# EAGLE design RAMPS_1.4.2.3 (EAGLE 7.5.0)
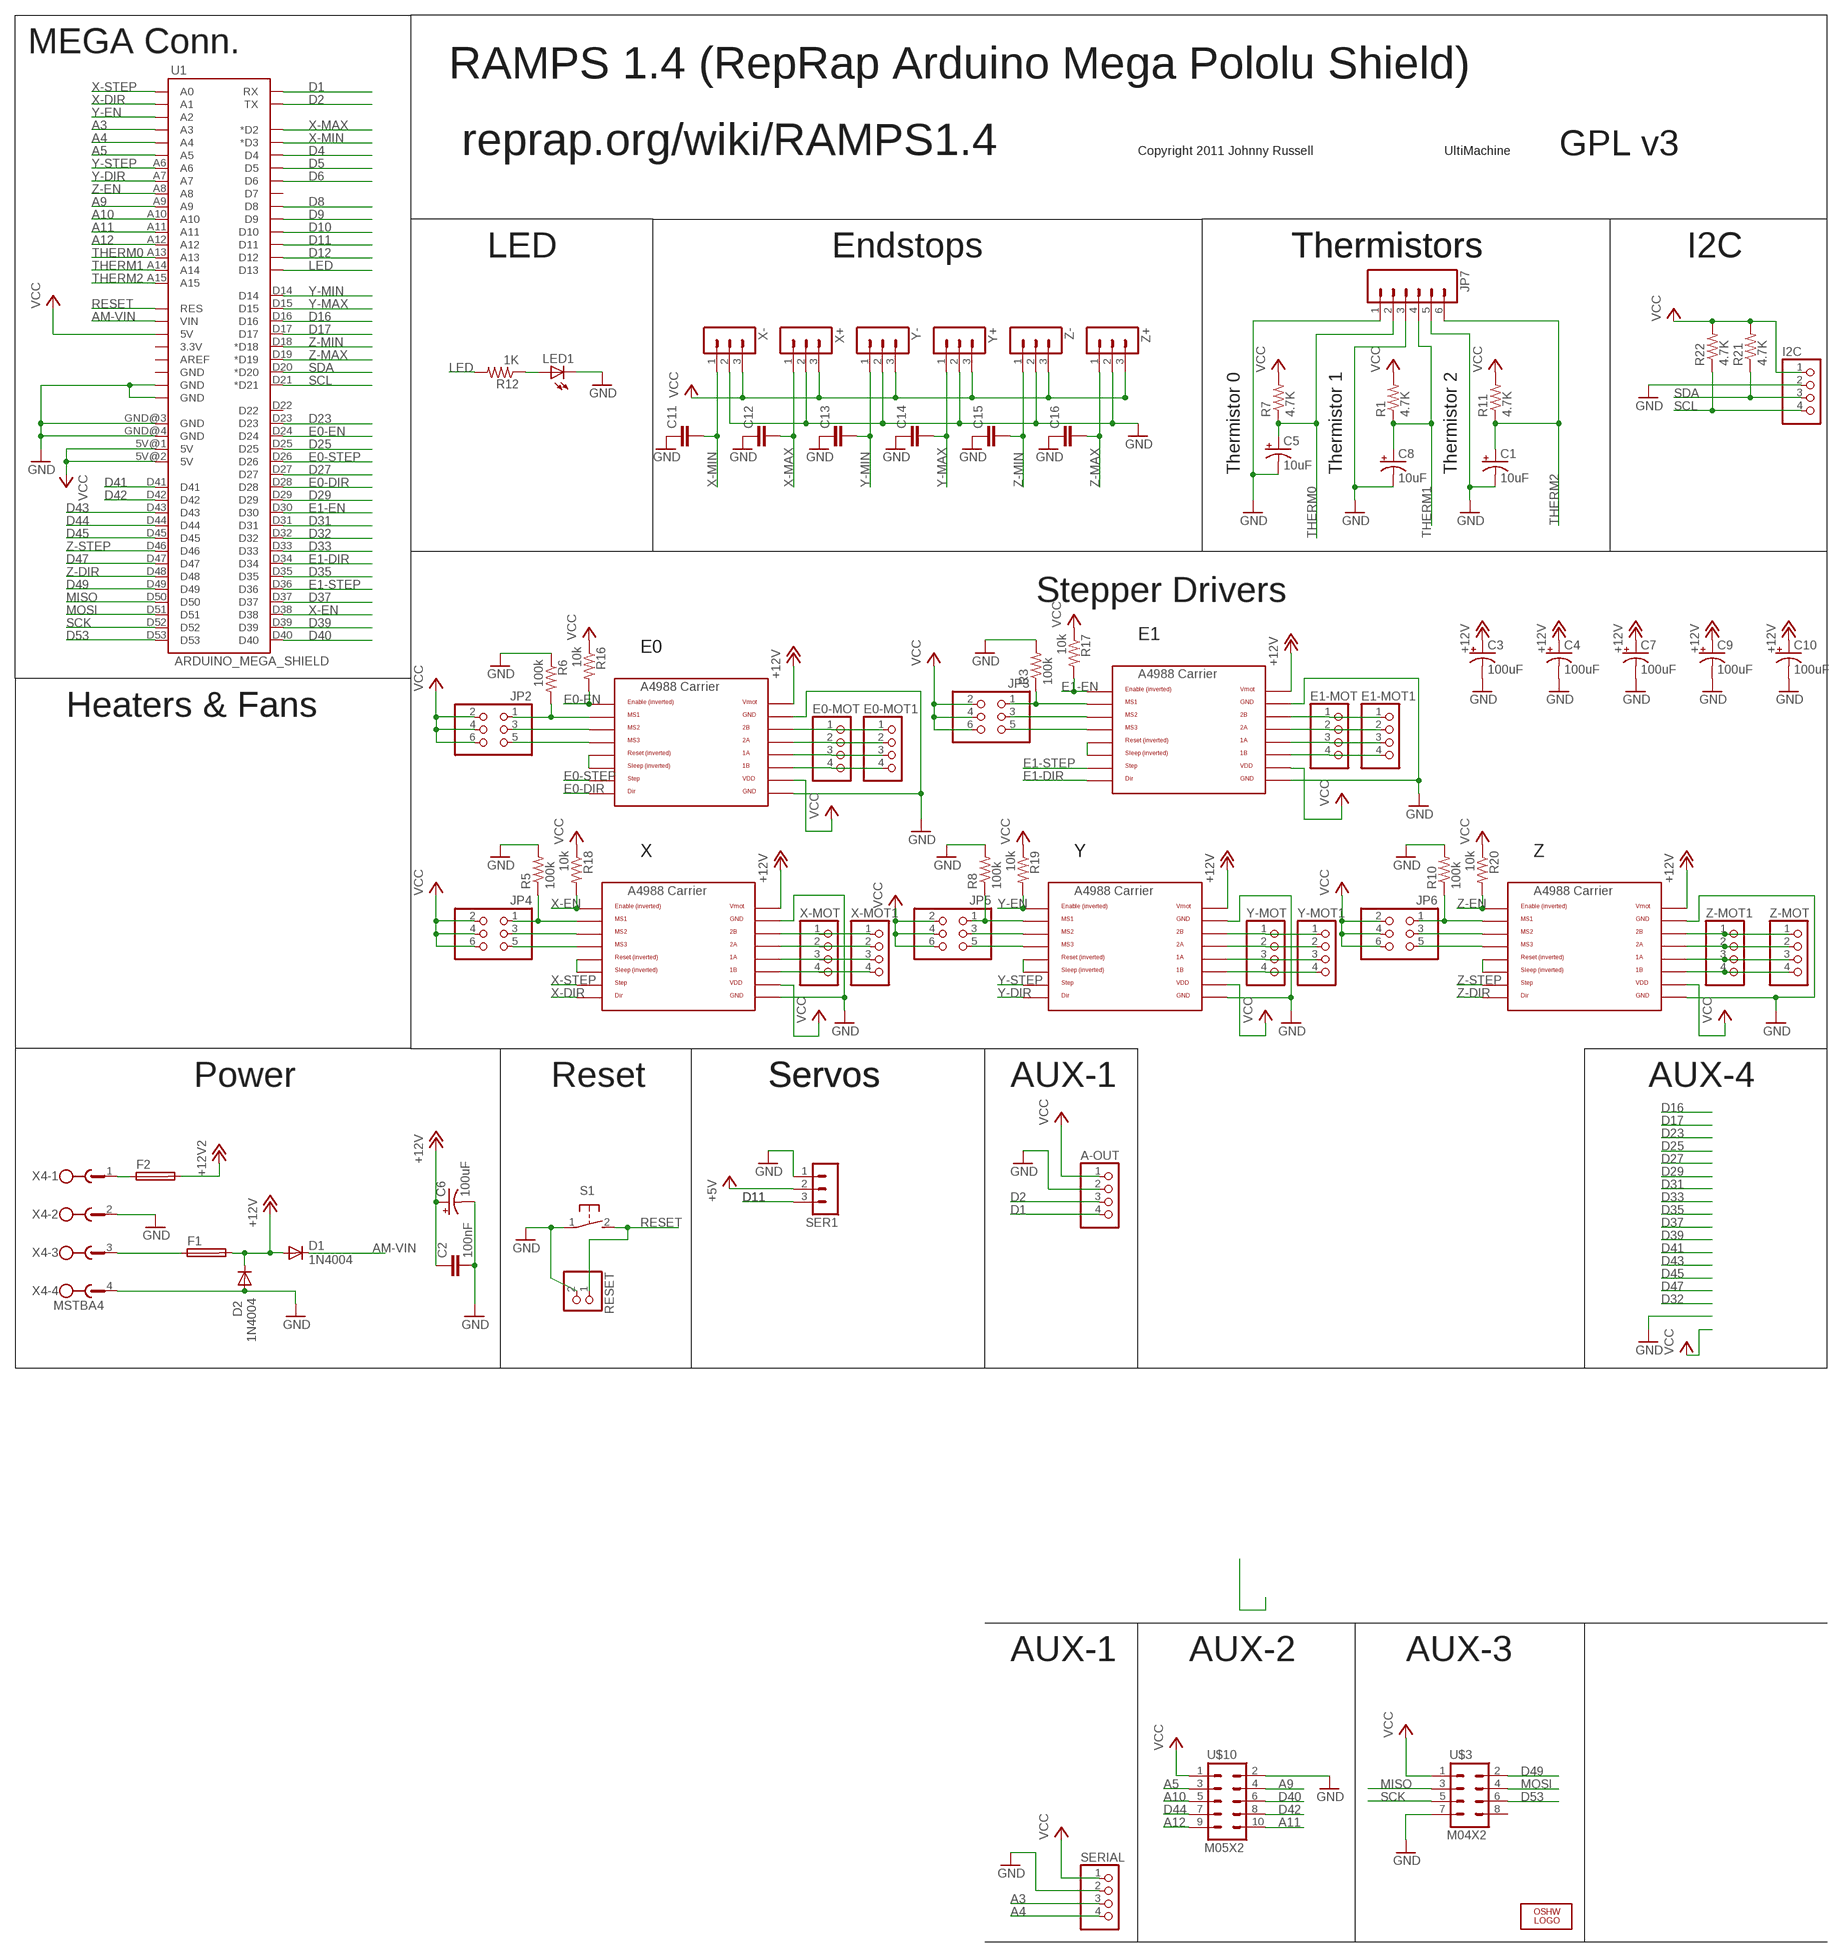
[diagram p0: schematic, sheet 1]

## Parts
A-OUT  PINHD-1X4  [1X04]
C1  10uF  CPOL-US153CLV-0405  [153CLV-0405]
C2  100nF  C-EUC0805  [C0805]
C3  100uF  CPOL-US153CLV-0605  [153CLV-0605]
C4  100uF  CPOL-US153CLV-0605  [153CLV-0605]
C5  10uF  CPOL-US153CLV-0405  [153CLV-0405]
C6  100uF  CPOL-US153CLV-0605  [153CLV-0605]
C7  100uF  CPOL-US153CLV-0605  [153CLV-0605]
C8  10uF  CPOL-US153CLV-0405  [153CLV-0405]
C9  100uF  CPOL-US153CLV-0605  [153CLV-0605]
C10  100uF  CPOL-US153CLV-0605  [153CLV-0605]
C11  C-EUC0805  [C0805]
C12  C-EUC0805  [C0805]
C13  C-EUC0805  [C0805]
C14  C-EUC0805  [C0805]
C15  C-EUC0805  [C0805]
C16  C-EUC0805  [C0805]
D1  1N4004  [DO41-10]
D2  1N4004  [DO41-10]
E0-MOT  PINHD-1X4  [1X04]
E0-MOT1  PINHD-1X4  [1X04]
E1-MOT  PINHD-1X4  [1X04]
E1-MOT1  PINHD-1X4  [1X04]
F1  FUSE_MCCQ-122  [FUSE_MCCQ-122]
F2  FUSE_MCCQ-122  [FUSE_MCCQ-122]
I2C  PINHD-1X4  [1X04]
JP2  PINHD-2X3  [2X03]
JP3  PINHD-2X3  [2X03]
JP4  PINHD-2X3  [2X03]
JP5  PINHD-2X3  [2X03]
JP6  PINHD-2X3  [2X03]
JP7  M06SIP  [1X06]
LED1  LEDCHIP-LED0805  [CHIP-LED0805]
LOGO1  OSHW_LOGO_6MILX0100-NT  [OSHW_6X100_NOTEXT]
R1  4.7K  R-US_R0805  [R0805]
R3  100k  R-US_R0805  [R0805]
R5  100k  R-US_R0805  [R0805]
R6  100k  R-US_R0805  [R0805]
R7  4.7K  R-US_R0805  [R0805]
R8  100k  R-US_R0805  [R0805]
R10  100k  R-US_R0805  [R0805]
R11  4.7K  R-US_R0805  [R0805]
R12  1K  R-US_R0805  [R0805]
R16  10k  R-US_R0805  [R0805]
R17  10k  R-US_R0805  [R0805]
R18  10k  R-US_R0805  [R0805]
R19  10k  R-US_R0805  [R0805]
R20  10k  R-US_R0805  [R0805]
R21  4.7K  R-US_R0805  [R0805]
R22  4.7K  R-US_R0805  [R0805]
RESET  PINHD-2  [PINHD-2]
S1  31-XX  [B3F-31XX]
SER1  3PIN-HEADER  [3PIN-HEADER]
SERIAL  PINHD-1X4  [1X04]
U1  ARDUINO_MEGA_SHIELD  [ARDUINO_MEGA_SHIELD]
U$3  M04X2  [2X4]
U$4  A4988BREAKOUT  [A4988BREAKOUT]
U$5  A4988BREAKOUT  [A4988BREAKOUT]
U$6  A4988BREAKOUT  [A4988BREAKOUT]
U$7  A4988BREAKOUT  [A4988BREAKOUT]
U$8  A4988BREAKOUT  [A4988BREAKOUT]
U$10  M05X2  [2X5]
X4  MSTBA4  [MSTBA4]
X+  3PIN-HEADER  [3PIN-HEADER]
X-  3PIN-HEADER  [3PIN-HEADER]
X-MOT  PINHD-1X4  [1X04]
X-MOT1  PINHD-1X4  [1X04]
Y+  3PIN-HEADER  [3PIN-HEADER]
Y-  3PIN-HEADER  [3PIN-HEADER]
Y-MOT  PINHD-1X4  [1X04]
Y-MOT1  PINHD-1X4  [1X04]
Z+  3PIN-HEADER  [3PIN-HEADER]
Z-  3PIN-HEADER  [3PIN-HEADER]
Z-MOT  PINHD-1X4  [1X04]
Z-MOT1  PINHD-1X4  [1X04]

## Nets
+5V: SER1.2
+12V: C2.1 C3.+ C4.+ C6.+ C7.+ C9.+ C10.+ D1.A D2.C F1.2-1 F1.2-2 U$4.VMOT U$5.VMOT U$6.VMOT U$7.VMOT U$8.VMOT
+12V2: F2.2-1 F2.2-2
A3: SERIAL.3 U1.A3
A4: SERIAL.4 U1.A4
A5: U1.A5 U$10.3
A9: U1.A9 U$10.4
A10: U1.A10 U$10.5
A11: U1.A11 U$10.10
A12: U1.A12 U$10.9
AM-VIN: D1.C U1.VIN
D1: A-OUT.4 U1.RX
D2: A-OUT.3 U1.TX
D4: U1.D4
D5: U1.D5
D6: U1.D6
D8: U1.D8
D9: U1.D9
D10: U1.D10
D11: SER1.3 U1.D11
D12: U1.D12
D16: U1.D16
D17: U1.D17
D23: U1.D23
D25: U1.D25
D27: U1.D27
D29: U1.D29
D31: U1.D31
D32: U1.D32
D33: U1.D33
D35: U1.D35
D37: U1.D37
D39: U1.D39
D40: U1.D40 U$10.6
D41: U1.D41
D42: U1.D42 U$10.8
D43: U1.D43
D44: U1.D44 U$10.7
D45: U1.D45
D47: U1.D47
D49: U1.D49 U$3.2
D53: U1.D53 U$3.6
E0-DIR: U1.D28 U$4.DIR
E0-EN: R16.2 U1.D24 U$4.EN
E0-STEP: U1.D26 U$4.STEP
E1-DIR: U1.D34 U$5.DIR
E1-EN: R17.2 U1.D30 U$5.EN
E1-STEP: U1.D36 U$5.STEP
GND: A-OUT.2 C1.- C2.2 C3.- C4.- C5.- C6.- C7.- C8.- C9.- C10.- C11.1 C12.1 C13.1 C14.1 C15.1 C16.1 D2.A I2C.2 JP7.1 JP7.3 JP7.5 LED1.C R3.2 R5.2 R6.1 R8.2 R10.2 RESET.2 S1.1(P) SER1.1 SERIAL.2 U1.GND@0(GND) U1.GND@1(GND) U1.GND@3(GND) U1.GND@4(GND) U$3.7 U$4.GND U$4.GND@0(GND) U$5.GND U$5.GND@0(GND) U$6.GND U$6.GND@0(GND) U$7.GND U$7.GND@0(GND) U$8.GND U$8.GND@0(GND) U$10.2 X4.2 X4.4 X+.2 X-.2 Y+.2 Y-.2 Z+.2 Z-.2
LED: R12.2 U1.D13
MISO: U1.D50 U$3.3
MOSI: U1.D51 U$3.4
N$3: E0-MOT1.1 E0-MOT.1 U$4.2B
N$4: E0-MOT1.2 E0-MOT.2 U$4.2A
N$5: JP2.1 R6.2 U$4.MS1
N$6: JP2.5 U$4.MS3
N$8: U$4.RST U$4.SLP(SLEEP)
N$9: JP2.3 U$4.MS2
N$10: E0-MOT1.3 E0-MOT.3 U$4.1A
N$11: E0-MOT1.4 E0-MOT.4 U$4.1B
N$12: E1-MOT1.1 E1-MOT.1 U$5.2B
N$13: E1-MOT1.2 E1-MOT.2 U$5.2A
N$14: JP4.1 R5.1 U$6.MS1
N$15: JP4.3 U$6.MS2
N$16: E1-MOT1.3 E1-MOT.3 U$5.1A
N$17: JP5.3 U$7.MS2
N$18: E1-MOT1.4 E1-MOT.4 U$5.1B
N$19: JP4.5 U$6.MS3
N$20: U$6.RST U$6.SLP(SLEEP)
N$21: U$6.2B X-MOT1.1 X-MOT.1
N$22: U$6.2A X-MOT1.2 X-MOT.2
N$23: U$7.RST U$7.SLP(SLEEP)
N$24: U$5.RST U$5.SLP(SLEEP)
N$25: JP3.1 R3.1 U$5.MS1
N$26: U$6.1A X-MOT1.3 X-MOT.3
N$27: U$6.1B X-MOT1.4 X-MOT.4
N$28: U$7.2B Y-MOT1.1 Y-MOT.1
N$29: U$7.2A Y-MOT1.2 Y-MOT.2
N$30: U$7.1A Y-MOT1.3 Y-MOT.3
N$31: JP5.5 U$7.MS3
N$33: JP5.1 R8.1 U$7.MS1
N$34: JP3.5 U$5.MS3
N$35: JP3.3 U$5.MS2
N$36: U$7.1B Y-MOT1.4 Y-MOT.4
N$37: JP6.3 U$8.MS2
N$38: U$8.RST U$8.SLP(SLEEP)
N$39: JP6.5 U$8.MS3
N$40: JP6.1 R10.1 U$8.MS1
N$41: U$8.2B Z-MOT1.1 Z-MOT.1
N$42: U$8.2A Z-MOT1.2 Z-MOT.2
N$43: U$8.1A Z-MOT1.3 Z-MOT.3
N$44: U$8.1B Z-MOT1.4 Z-MOT.4
N$46: LED1.A R12.1
N$53: F2.1-1 F2.1-2 X4.1
N$54: F1.1-1 F1.1-2 X4.3
RESET: RESET.1 S1.2(S) U1.RES
SCK: U1.D52 U$3.5
SCL: I2C.4 R22.1 U1.D21(*D21)
SDA: I2C.3 R21.1 U1.D20(*D20)
THERM0: C5.+ JP7.2 R7.1 U1.A13
THERM1: C8.+ JP7.4 R1.1 U1.A14
THERM2: C1.+ JP7.6 R11.1 U1.A15
VCC: A-OUT.1 I2C.1 JP2.2 JP2.4 JP2.6 JP3.2 JP3.4 JP3.6 JP4.2 JP4.4 JP4.6 JP5.2 JP5.4 JP5.6 JP6.2 JP6.4 JP6.6 R1.2 R7.2 R11.2 R16.1 R17.1 R18.1 R19.1 R20.1 R21.2 R22.2 SERIAL.1 U1.5V@0(5V) U1.5V@1(5V) U1.5V@2(5V) U$3.1 U$4.VDD U$5.VDD U$6.VDD U$7.VDD U$8.VDD U$10.1 X+.3 X-.3 Y+.3 Y-.3 Z+.3 Z-.3
X-DIR: U1.A1 U$6.DIR
X-EN: R18.2 U1.D38 U$6.EN
X-MAX: C12.2 U1.D2(*D2) X+.1
X-MIN: C11.2 U1.D3(*D3) X-.1
X-STEP: U1.A0 U$6.STEP
Y-DIR: U1.A7 U$7.DIR
Y-EN: R19.2 U1.A2 U$7.EN
Y-MAX: C14.2 U1.D15 Y+.1
Y-MIN: C13.2 U1.D14 Y-.1
Y-STEP: U1.A6 U$7.STEP
Z-DIR: U1.D48 U$8.DIR
Z-EN: R20.2 U1.A8 U$8.EN
Z-MAX: C16.2 U1.D19(*D19) Z+.1
Z-MIN: C15.2 U1.D18(*D18) Z-.1
Z-STEP: U1.D46 U$8.STEP
Unconnected: U1.3.3V U1.AREF U1.D7 U1.D22 U1.GND@2(GND) U$3.8

## Notes on the sheet
- MEGA Conn.
- RAMPS 1.4 (RepRap Arduino Mega Pololu Shield)
- reprap.org/wiki/RAMPS1.4 | Copyright 2011 Johnny Russell | UltiMachine | GPL v3
- LED | Endstops | Thermistors | Thermistors | I2C
- Thermistor 0 | Thermistor 1 | Thermistor 2
- Stepper Drivers
- E1
- E0
- Heaters & Fans
- X | Y | Z
- Power | Reset | Servos | Servos | AUX-1 | AUX-4
- AUX-1 | AUX-2 | AUX-3

## Library data of the parts
A-OUT E0-MOT E0-MOT1 E1-MOT E1-MOT1 I2C SERIAL X-MOT X-MOT1 Y-MOT Y-MOT1 Z-MOT Z-MOT1 = RepRapjr:PINHD-1X4: PIN HEADER
C1 C3-C10 = adafruit:CPOL-US: POLARIZED CAPACITOR, American symbol
C2 = resistor:C-EU: CAPACITOR, European symbol
C11-C16 = rcl:C-EU: CAPACITOR, European symbol
D1 D2 = diode:1N4004: DIODE general purpose rectifier, 1 A
F1 F2 = myLib:FUSE_MCCQ-122
JP2-JP6 = pinhead:PINHD-2X3: PIN HEADER
JP7 = SparkFun:M06: Header 6 Standard 6-pin 0.1" header. Use with straight break away headers (SKU : PRT-00116), right angle break away headers (PRT-00553), swiss pins (PRT-00743), machine pins (PRT-00117), and female headers (PRT-00115). Molex polarized connector foot print use with SKU : PRT-08094 with associated crimp pins and housings. NOTES ON THE VARIANTS LOCK and LOCK_LONGPADS... This footprint was designed to help hold the alignment of a through-hole component (i.e. 6-pin header) while soldering it into place. You may notice that each hole has been shifted either up or down by 0.005 of an inch from it's more standard position (which is a perfectly straight line). This slight alteration caused the pins (the squares in the middle) to touch the edges of the holes. Because they are alternating, it causes a "brace" to hold the component in place. 0.005 has proven to be the perfect amount of "off-center" position when using our standard breakaway headers. Although looks a little odd when you look at the bare footprint, once you have a header in there, the alteration is very hard to notice. Also, if you push a header all the way into place, it is covered up entirely on the bottom side. This idea of altering the position of holes to aid alignment will be further integrated into the Sparkfun Library for other footprints. It can help hold any component with 3 or more connection pins.
LED1 = led:LED: LED OSRAM: - CHIPLED LG R971, LG N971, LY N971, LG Q971, LY Q971, LO R971, LY R971 LH N974, LH R974 LS Q976, LO Q976, LY Q976 LO Q996 - Hyper CHIPLED LW Q18S LB Q993, LB Q99A, LB R99A - SideLED LS A670, LO A670, LY A670, LG A670, LP A670 LB A673, LV A673, LT A673, LW A673 LH A674 LY A675 LS A676, LA A676, LO A676, LY A676, LW A676 LS A679, LY A679, LG A679 - Hyper Micro SIDELED® LS Y876, LA Y876, LO Y876, LY Y876 LT Y87S - SmartLED LW L88C, LW L88S LB L89C, LB L89S, LG L890 LS L89K, LO L89K, LY L89K LS L896, LA L896, LO L896, LY L896 - TOPLED LS T670, LO T670, LY T670, LG T670, LP T670 LSG T670, LSP T670, LSY T670, LOP T670, LYG T670 LG T671, LOG T671, LSG T671 LB T673, LV T673, LT T673, LW T673 LH T674 LS T676, LA T676, LO T676, LY T676, LB T676, LH T676, LSB T676, LW T676 LB T67C, LV T67C, LT T67C, LS T67K, LO T67K, LY T67K, LW E67C LS E67B, LA E67B, LO E67B, LY E67B, LB E67C, LV E67C, LT E67C LW T67C LS T679, LY T679, LG T679 LS T770, LO T770, LY T770, LG T770, LP T770 LB T773, LV T773, LT T773, LW T773 LH T774 LS E675, LA E675, LY E675, LS T675 LS T776, LA T776, LO T776, LY T776, LB T776 LHGB T686 LT T68C, LB T68C - Hyper Mini TOPLED® LB M676 - Mini TOPLED Santana® LG M470 LS M47K, LO M47K, LY M47K Source: http://www.osram.convergy.de LUXEON: - LUMILED® LXK2-PW12-R00, LXK2-PW12-S00, LXK2-PW14-U00, LXK2-PW14-V00 LXK2-PM12-R00, LXK2-PM12-S00, LXK2-PM14-U00 LXK2-PE12-Q00, LXK2-PE12-R00, LXK2-PE12-S00, LXK2-PE14-T00, LXK2-PE14-U00 LXK2-PB12-K00, LXK2-PB12-L00, LXK2-PB12-M00, LXK2-PB14-N00, LXK2-PB14-P00, LXK2-PB14-Q00 LXK2-PR12-L00, LXK2-PR12-M00, LXK2-PR14-Q00, LXK2-PR14-R00 LXK2-PD12-Q00, LXK2-PD12-R00, LXK2-PD12-S00 LXK2-PH12-R00, LXK2-PH12-S00 LXK2-PL12-P00, LXK2-PL12-Q00, LXK2-PL12-R00 Source: www.luxeon.com KINGBRIGHT: KA-3528ASYC Source: www.kingbright.com
LOGO1 = OSHW:OSHW_LOGO_6MIL
R1 R3 R5-R8 R10-R12 R16-R22 = adafruit:R-US_: RESISTOR, American symbol
RESET = myLib:PINHD-2
S1 = switch-omron:31-XX: OMRON SWITCH; MPN: B3F-3100; OC_FARNELL: 959704; OC_NEWARK: 36M3582
SER1 X+ X- Y+ Y- Z+ Z- = ultimachine:3PIN-HEADER: PIN HEADER
U1 = RepRapjr:ARDUINO_MEGA_SHIELD
U$3 = SparkFun:M04X2
U$4-U$8 = RepRapjr:A4988BREAKOUT
U$10 = RepRapjr:M05X2
X4 = con-phoenix-508:MSTBA4: PHOENIX

## Board
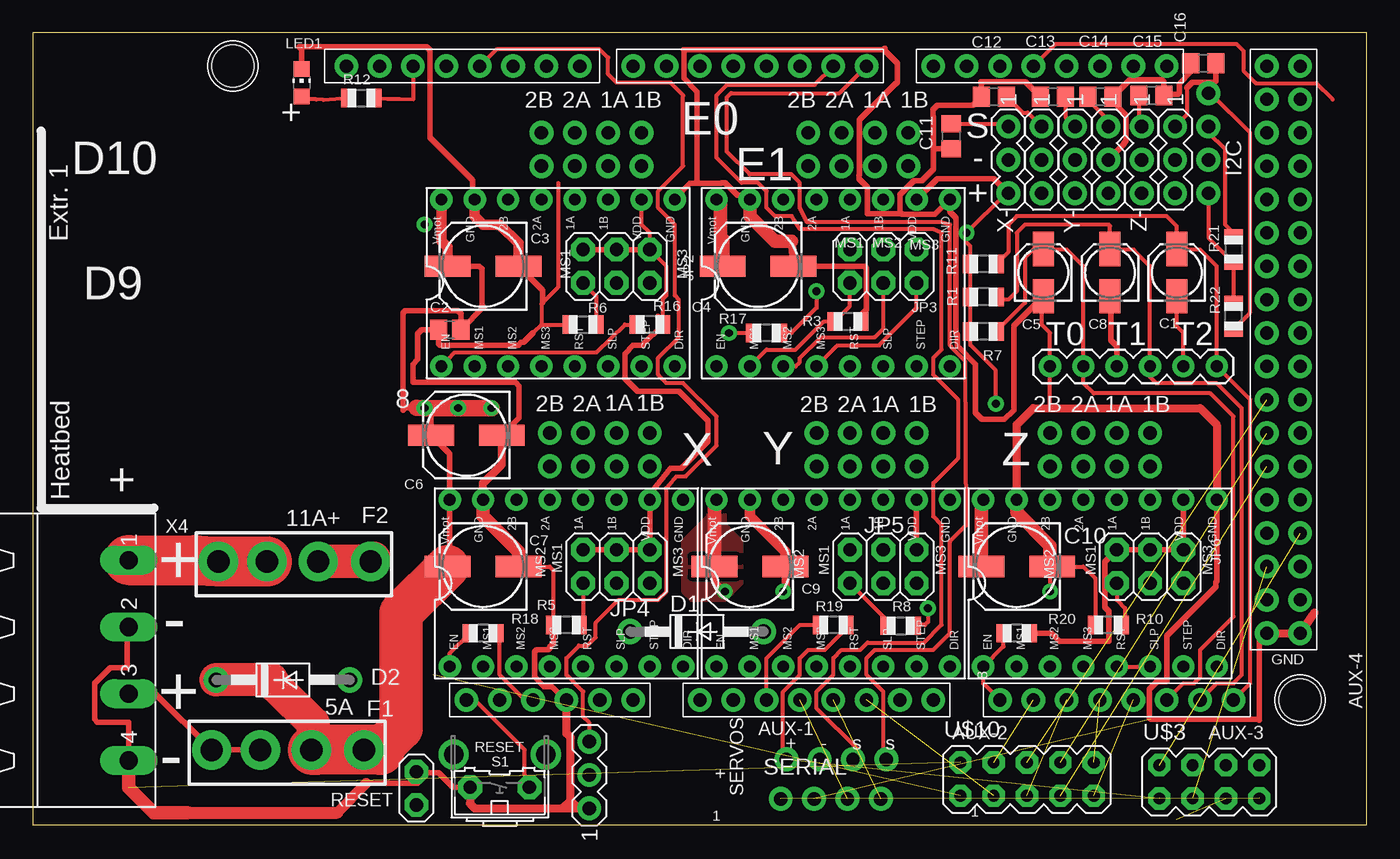
[diagram p1: board, top side]
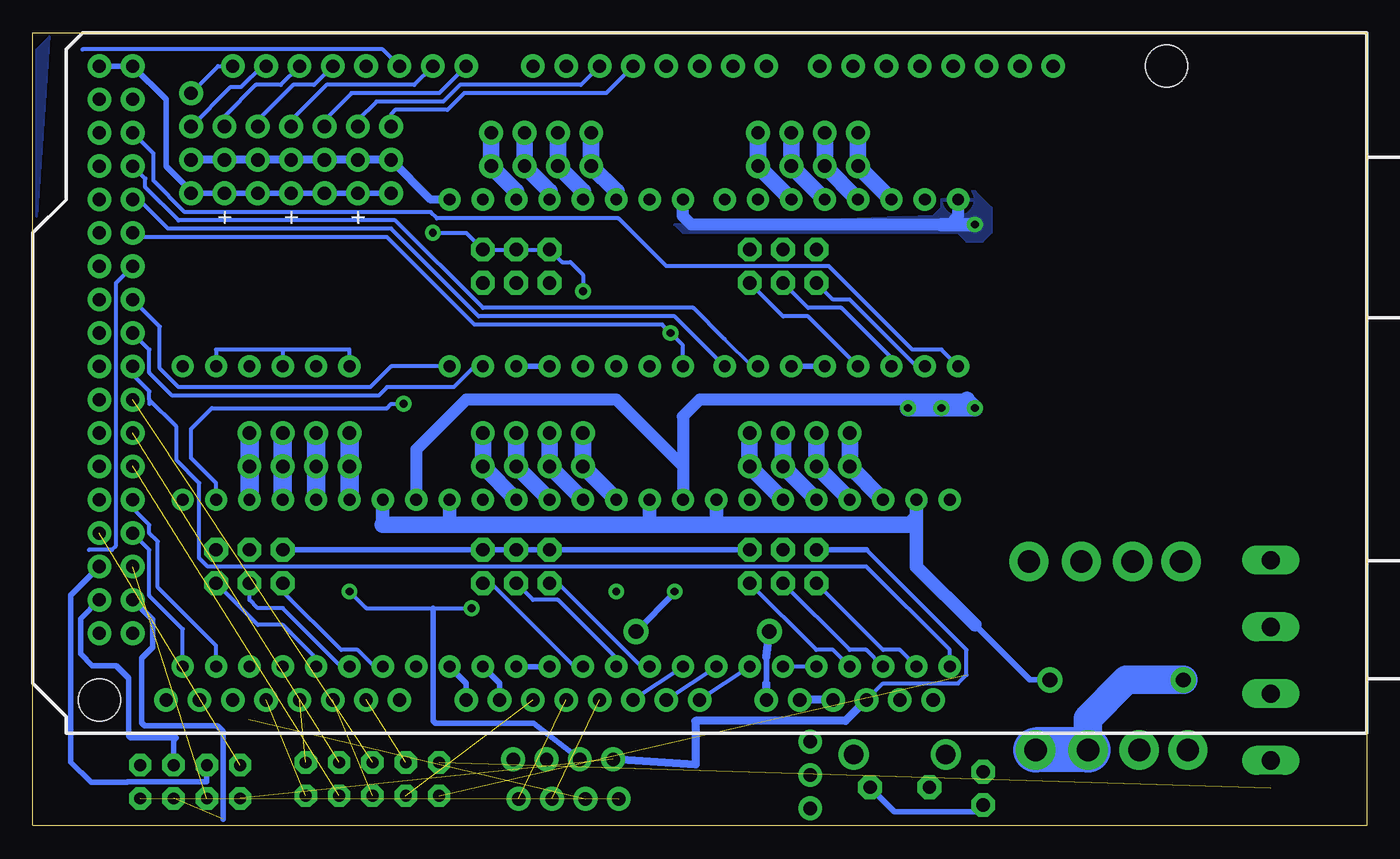
[diagram p2: board, bottom side, seen from below]

Size 101.59 x 60.31 mm. Coordinates in mm from the lower left corner, seen from the top.
Outline: 101.59,0 101.59,60.31 0,60.31 0,0 101.59,0
Copper layers (1*16): Top 0.035mm / dielectric 1.6mm / Bottom 0.035mm
Design rules "PCB-CART": minimum track width 0.2mm, minimum drill 0.4mm, track to track 0.2mm, track to pad 0.2mm, pad to pad 0.2mm, via to via 0.2mm, smd to smd 0.2mm, copper to edge 0.2mm, drill to drill 0.2mm, minimum pad ring 0.4mm, minimum via ring 0.3mm, stop-mask expansion 3mil, vias tented up to drill 0.5mm, thermal gap 12mil

### Footprints (pad centres in the part's own frame; a part is rotated, then mirrored left to right if it is on the bottom)
1X04 = drill 1.016: 1 -2.54,0; 2 0,0; 3 2.54,0; 4 5.08,0
153CLV-0405 = smd 2.6 x 1.6: + 1.8,0; - -1.8,0
C0805 = smd 1.3 x 1.5: 1 -0.85,0; 2 0.85,0
153CLV-0605 = smd 3.5 x 1.6: + 2.7,0; - -2.7,0
C0805' = smd 1.3 x 1.5: 1 -0.95,0; 2 0.95,0
DO41-10 = drill 1.118: A 5.08,0; C -5.08,0
FUSE_MCCQ-122 = drill 1.7 pad 3: 1-1 -6.7,0; 1-2 -3,0; 2-1 4.9,0; 2-2 0.9,0
2X03 = drill 1.016 octagon: 1 -2.54,-1.27; 2 -2.54,1.27; 3 0,-1.27; 4 0,1.27; 5 2.54,-1.27; 6 2.54,1.27
1X06 = drill 0.9 pad 1.422: 1 0,0; 2 2.54,0; 3 5.08,0; 4 7.62,0; 5 10.16,0; 6 12.7,0
CHIP-LED0805 = smd 1.2 x 1.2: A 0,-1.05; C 0,1.05
R0805 = smd 1.1 x 1.4: 1 -1,0; 2 1,0
PINHD-2 = drill 1.016 octagon: 1 -1.27,0; 2 1.27,0
B3F-31XX = drill 1.016 octagon: 1 -2.261,-1.245; 2 2.261,-1.245 | drill 1.499 pad 2.159: 3 -3.505,1.245; 4 3.505,1.245
3PIN-HEADER = drill 1.016: 1 -2.54,0; 2 0,0; 3 2.54,0
ARDUINO_MEGA_SHIELD = drill 1 pad 1.422: 3.3V 35.56,2.54; 5V@0 38.1,2.54; 5V@1 93.98,50.8; 5V@2 96.52,50.8; A0 50.8,2.54; A1 53.34,2.54; A2 55.88,2.54; A3 58.42,2.54; A4 60.96,2.54; A5 63.5,2.54; A6 66.04,2.54; A7 68.58,2.54; A8 73.66,2.54; A9 76.2,2.54; A10 78.74,2.54; A11 81.28,2.54; A12 83.82,2.54; A13 86.36,2.54; A14 88.9,2.54; A15 91.44,2.54; AREF 23.876,50.8; D2 58.42,50.8; D3 55.88,50.8; D4 53.34,50.8; D5 50.8,50.8; D6 48.26,50.8; D7 45.72,50.8; D8 41.656,50.8; D9 39.116,50.8; D10 36.576,50.8; D11 34.036,50.8; D12 31.496,50.8; D13 28.956,50.8; D14 68.58,50.8; D15 71.12,50.8; D16 73.66,50.8; D17 76.2,50.8; D18 78.74,50.8; D19 81.28,50.8; D20 83.82,50.8; D21 86.36,50.8; D22 93.98,48.26; D23 96.52,48.26; D24 93.98,45.72; D25 96.52,45.72; D26 93.98,43.18; D27 96.52,43.18; D28 93.98,40.64; D29 96.52,40.64; D30 93.98,38.1; D31 96.52,38.1; D32 93.98,35.56; D33 96.52,35.56; D34 93.98,33.02; D35 96.52,33.02; D36 93.98,30.48; D37 96.52,30.48; D38 93.98,27.94; D39 96.52,27.94; D40 93.98,25.4; D41 96.52,25.4; D42 93.98,22.86; D43 96.52,22.86; D44 93.98,20.32; D45 96.52,20.32; D46 93.98,17.78; D47 96.52,17.78; D48 93.98,15.24; D49 96.52,15.24; D50 93.98,12.7; D51 96.52,12.7; D52 93.98,10.16; D53 96.52,10.16; GND@0 40.64,2.54; GND@1 43.18,2.54; GND@2 26.416,50.8; GND@3 93.98,7.62; GND@4 96.52,7.62; RES 33.02,2.54; RX 63.5,50.8; TX 60.96,50.8; VIN 45.72,2.54 | hole 3.2: 96.52,2.54; 15.24,50.8
2X4 = drill 0.9 pad 1.422 octagon: 1 -3.81,-1.27; 2 -3.81,1.27; 3 -1.27,-1.27; 4 -1.27,1.27; 5 1.27,-1.27; 6 1.27,1.27; 7 3.81,-1.27; 8 3.81,1.27
A4988BREAKOUT = drill 0.9: 1A 8.89,1.27; 1B 11.43,1.27; 2A 6.35,1.27; 2B 3.81,1.27; DIR 16.51,-11.43; EN -1.27,-11.43; GND 16.51,1.27; GND@0 1.27,1.27; MS1 1.27,-11.43; MS2 3.81,-11.43; MS3 6.35,-11.43; RST 8.89,-11.43; SLP 11.43,-11.43; STEP 13.97,-11.43; VDD 13.97,1.27; VMOT -1.27,1.27
2X5 = drill 0.9 pad 1.422 octagon: 1 -3.81,-1.27; 2 -3.81,1.27; 3 -1.27,-1.27; 4 -1.27,1.27; 5 1.27,-1.27; 6 1.27,1.27; 7 3.81,-1.27; 8 3.81,1.27; 9 6.35,-1.27; 10 6.35,1.27
MSTBA4 = drill 1.397 long: 1 -7.62,5.08; 2 -2.54,5.08; 3 2.54,5.08; 4 7.62,5.08

### Placement (x,y rotation side)
A-OUT  59.92,5 0 top
C1  87.12,42.06 90 top
C2  31.75,37.71 180 top
C3  34.29,42.54 180 top
C4  55.24,42.54 180 top
C5  76.96,42.06 90 top
C6  33.02,29.69 180 top
C7  34.29,19.69 180 top
C8  82.04,42.06 90 top
C9  54.61,19.69 180 top
C10  74.93,19.69 180 top
C11  [C0805']  69.95,52.45 90 top
C12  [C0805']  73.2,55.45 0 top
C13  [C0805']  77.7,55.45 0 top
C14  [C0805']  81.3,55.45 180 top
C15  [C0805']  85.2,55.54 180 top
C16  [C0805']  89.15,57.99 0 top
D1  50.57,14.73 0 top
D2  19.05,11.05 0 top
E0-MOT  41.27,52.7 0 top
E0-MOT1  41.27,50.16 0 top
E1-MOT  61.59,52.7 0 top
E1-MOT1  61.59,50.16 0 top
F1  20.32,5.71 0 top
F2  20.83,20.07 0 top
I2C  89.53,50.64 90 top
JP2  44.45,42.54 0 top
JP3  64.77,42.54 0 top
JP4  44.45,19.69 0 top
JP5  64.77,19.69 0 top
JP6  85.09,19.69 0 top
JP7  77.47,34.92 0 top
LED1  20.48,56.51 0 top
LOGO1  -5.8,-44.55 0 top  (outside the outline)
R1  72.39,40.22 180 top
R3  62.08,38.35 0 top
R5  40.64,15.24 180 top
R6  41.91,38.1 0 top
R7  72.39,37.58 180 top
R8  66.1,15.18 0 top
R10  81.92,15.24 180 top
R11  72.39,42.7 180 top
R12  25.03,55.36 0 top
R16  46.99,38.1 180 top
R17  55.88,37.46 180 top
R18  34.29,14.6 180 top
R19  60.96,15.24 180 top
R20  74.93,14.6 180 top
R21  91.44,43.81 270 top
R22  91.44,38.73 90 top
RESET  29.21,2.79 90 top
S1  35.56,4.13 0 top
SER1  42.39,3.81 90 top
SERIAL  59.5,1.99 0 top
U1  0,6.98 0 top
U$3  89.6,3.29 0 top
U$4  32.38,46.35 0 top
U$5  53.34,46.35 0 top
U$6  33.02,23.49 0 top
U$7  53.34,23.49 0 top
U$8  73.66,23.49 0 top
U$10  74.45,3.49 0 top
X4  2.22,12.54 270 top
X+  76.83,50.64 270 top
X-  74.3,50.64 270 top
X-MOT  41.91,29.84 0 top
X-MOT1  41.91,27.3 0 top
Y+  81.92,50.64 270 top
Y-  79.38,50.64 270 top
Y-MOT  62.23,29.84 0 top
Y-MOT1  62.23,27.3 0 top
Z+  87,50.64 270 top
Z-  84.45,50.64 270 top
Z-MOT  80.01,29.84 0 top
Z-MOT1  80.01,27.3 0 top

### Tracks (layer width: path | path; a pad name or v marks a point on that pad's centre or on a via)
+12V  (via drill 0.6)
  Top 0.2: 21.59,5.71 F1.2-2
  Top 0.406: C9.+ 51.91,18.57 v52.7,17.78 | C3.+ 34,42.54 34.2,42.34 34.2,39.54 34.3,39.45 34.3,39.41 C2.1 32.6,38.95 32.4,39.14 28.35,39.14 28.2,38.99 28.2,31.59 28.37,31.77 29.21,31.77 | C7.+ 31.75,19.84 U$6.VMOT 31.75,28.26 C6.+ 30.32,31.27 v29.84,31.75
  Top 0.813: C3.+ 31.59,43.97 31.11,44.45 U$4.VMOT
  Top 1.016: C9.+ 51.91,24.6 U$7.VMOT | C10.+ 72.23,24.6 U$8.VMOT | C4.+ 52.55,44.61 52.39,44.77 52.39,47.31 U$5.VMOT
  Top 1.27: 29.21,31.77 v29.84,31.75 v32.38,31.75 v34.92,31.75
  Top 2.54: D2.C 18.14,11.1 18.54,10.54 21.34,7.75 21.34,5.83
  Top 3.302: 21.34,5.83 F1.2-2 | 26.42,5.71 28.07,7.37 28.07,16.16 C7.+
  Top 3.81: 26.42,5.71 21.59,5.71 21.34,5.71
  Bottom 0.406: v52.7,17.78 52.7,17.68 D1.A
  Bottom 0.914: U$4.VMOT 31.11,46.35 31.75,45.72 32.38,45.72 51.44,45.72 52.07,46.35 U$5.VMOT | U$8.VMOT 72.39,28.57 68.58,32.38 57.15,32.38 52.07,27.3 | 52.07,27.3 U$7.VMOT | 52.07,27.3 52.07,31.11 50.8,32.38 30.45,32.38
  Bottom 1.016: 32.38,45.72 v29.84,45.72
  Bottom 1.27: 30.45,32.38 30.45,32.35 v29.84,31.75 v34.92,31.75 | U$6.VMOT
  Bottom 2.184: F1.2-2 21.25,8.09 18.29,11.05 D2.C
  Bottom 3.429: F1.2-2 F1.2-1
  pour Top: 51.44,24.13 51.44,23.49 49.53,21.59 49.53,17.78 50.16,17.14 52.7,17.14 53.98,18.41 53.98,21.59 52.7,22.86 52.7,24.13 52.07,24.77
  pour Top: 51.44,48.26 52.7,46.35 52.7,47.62 52.07,48.26
  pour Bottom: 28.57,46.35 28.57,46.99 29.84,48.26 31.75,48.26 32.38,47.62 32.38,46.99 33.02,46.35 52.7,45.72 52.07,45.09 31.11,45.09 30.48,44.45 29.21,44.45 28.57,45.09
+12V2
  Top 0.2: F2.2-1 26.67,20.95 25.94,20.3
  Top 2.54: F2.2-2 F2.2-1 | 25.94,20.3 26.04,20.19
A3  (1 unrouted)
A4  (1 unrouted)
A5  (1 unrouted)
A9  (1 unrouted)
A10  (1 unrouted)
A11  (1 unrouted)
A12  (1 unrouted)
AM-VIN
  Bottom 0.406: 45.72,10.79 45.72,12.81
  Bottom 0.61: 45.72,12.81 D1.C | U1.VIN 45.72,10.79
D1
  Top 0.305: U1.RX 61.44,55.72 53.18,55.72 52.86,55.4 52.86,51.28 54.61,49.53 57.78,49.53 58.42,48.89 58.42,46.99 58.95,45.9 69.11,45.9 69.85,45.72 69.85,36.51 70.17,36.2 70.39,35.95 71.02,35.31 71.12,22.86 69.85,21.59 69.85,14.6 68.58,13.33 64.14,13.33 63.5,12.7 63.5,11.43 64.77,10.16 64.77,4.6 A-OUT.4
D2
  Top 0.305: U1.TX 59.53,56.36 52.86,56.36 52.07,55.56 52.07,50.8 53.98,48.89 55.24,48.89 55.88,48.26 55.88,46.99 56.52,46.35 57.78,46.35 58.42,45.37 68.58,45.37 69.22,45.09 69.22,36.2 68.58,35.56 68.58,34.29 70.48,32.38 70.48,27.94 68.58,26.03 68.58,23.49 69.22,22.86 69.22,15.24 67.87,13.89 63.58,13.89 63.02,13.33 61.59,13.33 60.96,12.7 60.96,11.43 59.69,10.16 59.69,8.89 62.87,5.71 A-OUT.3
D11
  Top 0.305: SER1.3 42.39,7.78 41.91,8.26 41.91,10.16 40.64,11.43 40.64,12.7 41.59,13.65 42.23,13.65 42.86,14.29 42.86,15.4 44.61,17.14 47.62,17.14 48.26,17.78 48.26,25.65 49.02,26.54 49.72,26.54 52.07,28.89 52.07,31.11 49.53,33.65 48.26,33.65 47.62,34.29 47.62,35.56 49.21,37.15 49.21,40 48.9,40.32 48.9,45.72 47.62,46.99 47.62,48.26 49.53,50.16 49.53,55.56 48.58,56.51 44.45,56.51 43.81,57.15 43.81,58.42 43.18,59.05 35.31,59.05 U1.D11
D16
  Bottom 0.305: 97.79,59.05 74.93,59.05 U1.D16
D17
  Top 0.3: 93.15,56.49 97.75,56.49
  Top 0.305: 99,55.24 97.75,56.49 | U1.D17 77.86,59.45 91.7,59.45 92.2,58.95 92.2,57.45 93.15,56.49
D32
  Bottom 0.305: U1.D32 95.25,41.27 95.25,21.27 95.57,20.95 97.31,20.95
D40  (1 unrouted)
D42  (1 unrouted)
D44  (1 unrouted)
D49  (1 unrouted)
D53
  Bottom 0.406: U1.D53 97.95,15.71 97.95,13.04 97.05,12.14 95.25,12.14 94.3,11.19 94.3,6.79 94.15,6.64 90.65,6.64 90.87,6.42 U$3.6
E0-DIR
  Bottom 0.305: U1.D28 93.5,47.62 91.28,45.4 74.3,45.4 67.63,38.73 52.7,38.73 U$4.DIR
E0-EN
  Top 0.305: R16.2 45.09,38.1 42.93,35.99 32.13,35.99 U$4.EN
  Bottom 0.305: U1.D24 92.39,51.12 92.39,49.05 90.01,46.67 71.28,46.67 70.8,46.2 56.99,46.2 53.34,42.54 40.96,42.54 34.61,36.2 32.38,36.2 U$4.EN
E0-STEP
  Bottom 0.254: 48.9,36.99 46.83,34.92 U$4.STEP
  Bottom 0.305: U1.D26 93.03,49.21 93.03,48.58 90.49,46.04 73.98,46.04 67.31,39.37 51.28,39.37 48.9,36.99
E1-DIR
  Bottom 0.305: U1.D34 91.92,37.94 91.92,34.77 90.49,33.34 75.88,33.34 74.3,34.92 U$5.DIR
E1-EN  (via drill 0.6)
  Top 0.305: v53.02,37.46 R17.2
  Bottom 0.305: U1.D30 93.66,44.77 74.61,44.77 67.94,38.1 53.66,38.1 v53.02,37.46 52.07,36.51 U$5.EN
E1-STEP
  Bottom 0.305: U1.D36 92.71,36.2 92.71,34.45 90.96,32.7 75.25,32.7 74.61,33.34 69.53,33.34 67.94,34.92 U$5.STEP
GND  (via drill 0.6)  (3 unrouted)
  Top 0.305: C3.- 37.2,42.34 | 38.73,38.1 R6.1 | 38.73,38.1 38.1,37.46 | R10.2 80.92,18.78 80.01,19.69 C10.- 77.47,19.52 v77.47,17.78 | C5.- 76.83,40.13 76.83,38.1 77.47,37.46 JP7.1 77.47,31.75 | R8.2 67.17,15.24 67.94,15.24 68.17,15.47 v68.17,16.51 | R5.2 39.64,19.41 39.37,19.69 C7.- | C1.- 87.12,37.97 87.63,37.46 JP7.5 | 38.73,38.1 38.73,39.69 38.82,39.77 40.01,40.96 40.01,48.89
  Top 0.406: U1.GND@3 93.4,14.03 93.4,7.99 93.35,8.04 85.15,8.04 85.05,8.14 85.05,10.35 85.6,10.89 86.3,10.89 86.35,10.94 86.35,14.39 90.1,18.14 90.1,18.49 90.17,18.56 U$8.GND | R5.2 39.65,15.23 39.65,13.85 39.4,13.6 39.4,13.49 39.25,13.35 38.35,13.35 38.2,13.19 38.2,11.29 38.95,10.54 39.55,10.54 40.57,9.53 U1.GND@0 | U$4.GND@0 33.5,47.78 33.5,49.09 30.25,52.34 30.25,58.99 30,59.24 20.3,59.24 20.48,59.07 LED1.C | X4.2 7.2,14.98 7.2,12.04 7.15,11.99 5.9,11.99 4.7,10.79 4.7,8.04 4.9,7.85 7.3,7.85 7.3,7.84 X4.4 | C6.- 37.05,31.02 37.05,33.39 36.75,33.7 28.95,33.7 28.95,35.09 29.3,35.45 29.3,37.39 29.62,37.71 C2.2 30.9,36.64 31,36.54 37,36.54 37.2,36.74 37.38,36.74 38.1,37.46 | 37.2,42.34 38.82,40.71 38.82,39.77 | Y+.2 83.1,51.83 83.1,51.89 83.25,52.04 83.25,54.09 82.25,55.09 C14.1 83.55,56.74 86,56.74 86.15,56.59 C15.1 86.25,55.64 87.2,55.64 87.3,55.74 87.3,56.45 88.2,57.34 C16.1 | C13.1 75.6,56.59 72.2,56.59 72.25,56.54 C12.1 71.6,54.79 68.9,54.79 68.55,54.45 68.55,53.99 68.6,53.95 68.6,51.45 | 68.6,51.45 68.65,51.49 C11.1 | 25.4,3.17 25.42,3.19 29.3,3.19 29.21,3.28 RESET.2 29.28,3.99 30.9,3.99 32.01,2.88 S1.1 | U$5.GND@0 54.29,47.95 53.65,47.95 52.7,48.89 52.45,48.89 52.4,48.84 50.6,48.84 | 50.6,48.84 50.05,48.84 48.9,47.69 U$4.GND | C8.- 82.1,40.2 82.1,36.89 82.55,36.45 JP7.3 | C4.- 63.35,42.54 63.5,42.39 63.5,39.24 63.08,38.82 R3.2 | C5.- 74.7,38 74.7,31.59 74,30.89 72.3,30.89 71.8,31.39 71.8,35.09 70.4,36.49 70.4,37.34 70.3,37.45 70.3,46.24 69.85,46.7 U$5.GND 68.72,46.49 66.2,46.49 66.15,46.54 | 66.15,46.54 66.05,46.64 66.05,47.99 67.1,49.04 67.7,49.04 68.6,49.95 68.6,51.45
  Top 0.406: 66.15,46.54 63.55,46.54 63.55,48.54 62.9,49.2 62.9,49.45 62.95,49.49 62.95,53.7 65.75,56.49 65.8,56.49 65.85,56.54 65.85,57.99 64.9,58.95 64.9,59.15 64.8,59.04 49.55,59.04 49.6,58.99 49.6,56.84 50.6,55.84 50.6,48.84
  Top 0.61: U1.GND@3 U1.GND@4 97.63,16.19 | U$8.GND 90.17,30.48 88.9,31.75 77.47,31.75 76.2,31.75 74.93,30.48 U$8.GND@0 | S1.1 33.3,1.63 33.66,1.27 40.32,1.27 | 40.96,1.27 40.96,1.9 | 40.96,1.9 40.96,6.67 40.64,6.98 U1.GND@0 | 40.32,1.27 40.96,1.27 | 57.78,44.45 57.95,43.02 C4.- | v57.15,17.78 57.31,17.94 C9.- | 40.96,1.27 41.59,1.27 | 41.59,1.27 SER1.1 | SER1.1 | 40.32,1.27 40.96,1.9 | 40.96,1.9 41.59,1.27 | C6.- 35.72,27.46 34.29,26.03 U$6.GND@0 | U$6.GND@0
  Top 0.813: C3.- 36.99,44.29 35.56,45.72 34.29,45.72 33.66,46.35 U$4.GND@0 | C9.- 57.31,20.8 54.61,23.49 U$7.GND@0 | 23.18,0.95 25.4,3.17
  Top 0.914: 11.75,0.95 23.18,0.95
  Top 1.016: C7.- 36.99,20.8 34.29,23.49 U$6.GND@0 | U$8.GND@0 74.93,23.81 77.47,21.27 77.47,19.84 C10.- | U$5.GND@0 54.61,46.35 56.52,44.45 57.78,44.45 | 11.75,0.95 9.21,0.95 7.3,2.86 X4.4 7.3,5.08
  Bottom 0.305: 77.47,35.24 JP7.1 77.47,36.2 82.55,36.2 | v68.17,16.51 71.1,16.51 76.2,16.51 v77.47,17.78 | 82.55,36.2 JP7.3 | 82.55,36.2 87.63,36.2 JP7.5 | Z+.2
  Bottom 0.406: 29.84,15.24 25.65,11.05 D2.A | A-OUT.2 63.47,7.74 70.9,7.74 71.1,7.94 71.1,16.51
  Bottom 0.61: I2C.2 Z+.2 Z-.2 Y+.2 Y-.2 X+.2 X-.2 71.28,47.62 U$5.GND | U1.GND@0 U1.GND@1
  Bottom 0.914: X4.4 7.46,5.08 | U$6.GND@0
  Bottom 1.016: 74.93,22.86 U$8.GND@0 | 69.85,22.86 U$7.GND | 54.61,22.86 U$7.GND@0 | U$6.GND | 49.53,22.86 U$6.GND | 34.92,22.86 34.29,23.49 U$6.GND@0 34.29,19.69 29.84,15.24
  Bottom 1.27: 34.92,22.86 49.53,22.86 54.61,22.86 69.85,22.86 74.93,22.86
  Bottom 1.676: U$6.GND@0
  pour Bottom: 100.33,60.01 101.28,59.05 101.28,46.35
  pour Bottom: 71.75,43.18 72.39,43.81 73.66,43.81 74.3,44.45
LED
  Top 0.305: U1.D13 28.96,57.53 28.99,56.81 28.98,55.27 27.9,55.28 27.05,55.28 R12.2
MISO  (1 unrouted)
MOSI
  Bottom 0.406: U1.D51 98.7,17.51 98.7,4.79 97.15,3.24 94.4,3.24 94.35,3.29 88.35,3.29 88.33,3.31 U$3.4
N$3
  Bottom 1.27: U$4.2B E0-MOT1.1 E0-MOT.1 | E0-MOT.1
N$4
  Bottom 1.27: U$4.2A E0-MOT1.2 E0-MOT.2 | E0-MOT.2
N$5
  Top 0.305: R6.2 42.91,40.27 JP2.1
  Bottom 0.305: U$4.MS1 34.29,34.92 39.37,40 40.64,40 JP2.1
N$6
  Bottom 0.305: U$4.MS3 42.55,38.73 44.45,38.73 JP2.5
N$8
  Bottom 0.406: U$4.RST U$4.SLP
N$9
  Bottom 0.305: U$4.MS2 36.2,35.56 40.01,39.37 42.55,39.37 JP2.3
N$10
  Bottom 1.27: U$4.1A E0-MOT1.3 E0-MOT.3 | E0-MOT.3
N$11
  Bottom 1.27: U$4.1B E0-MOT1.4 E0-MOT.4 | E0-MOT.4
N$12
  Bottom 1.27: U$5.2B 57.15,48.26 E1-MOT1.1 E1-MOT.1
N$13
  Bottom 1.27: U$5.2A 59.69,48.26 E1-MOT1.2 E1-MOT.2
N$14
  Top 0.305: R5.1 41.91,15.51 JP4.1
  Bottom 0.305: U$6.MS1 35.56,13.33 36.83,13.33 JP4.1
N$15
  Bottom 0.305: U$6.MS2 38.1,13.33 39.37,13.33 JP4.3
N$16
  Bottom 1.27: U$5.1A 62.23,48.26 E1-MOT1.3 E1-MOT.3
N$17
  Bottom 0.305: U$7.MS2 57.15,12.7 61.59,17.14 63.5,17.14 JP5.3
N$18
  Bottom 1.27: U$5.1B 64.77,48.26 E1-MOT1.4 E1-MOT.4
N$19
  Bottom 0.305: U$6.MS3 40.64,13.33 41.91,13.33 JP4.5
N$20
  Bottom 0.305: U$6.RST U$6.SLP
N$21
  Bottom 1.27: U$6.2B | U$6.2B X-MOT1.1 X-MOT.1
N$22
  Bottom 1.27: U$6.2A | U$6.2A X-MOT1.2 X-MOT.2
N$23
  Bottom 0.406: U$7.RST U$7.SLP
N$24
  Bottom 0.406: U$5.RST U$5.SLP
N$25
  Top 0.305: U$5.MS1 55.88,36.2 58.1,36.2 60.26,38.35 R3.1 62.23,39.5 JP3.1
N$26
  Bottom 1.27: U$6.1A | U$6.1A X-MOT1.3 X-MOT.3
N$27
  Bottom 1.27: U$6.1B | U$6.1B X-MOT1.4 X-MOT.4
N$28
  Bottom 1.27: U$7.2B Y-MOT1.1 Y-MOT.1
N$29
  Bottom 1.27: U$7.2A Y-MOT1.2 Y-MOT.2
N$30
  Bottom 1.27: U$7.1A Y-MOT1.3 Y-MOT.3
N$31
  Bottom 0.305: U$7.MS3 60.33,12.06 66.67,18.41 JP5.5
N$33
  Top 0.305: R8.1 65.1,15.54 JP5.1
  Bottom 0.305: U$7.MS1 55.24,12.06 61.59,18.41 JP5.1
N$34
  Top 0.305: JP3.5 67.31,39.37 64.45,36.51 61.28,36.51 U$5.MS3
N$35
  Top 0.305: JP3.3 64.77,37.78 64.14,37.15 60.01,37.15 58.42,35.56 58.42,35.24 58.1,34.92 U$5.MS2
N$36
  Bottom 1.27: U$7.1B Y-MOT1.4 Y-MOT.4
N$37
  Bottom 0.305: U$8.MS2 78.11,12.06 82.55,16.51 84.45,16.51 85.09,17.14 JP6.3
N$38
  Top 0.305: U$8.RST U$8.SLP
N$39
  Bottom 0.305: U$8.MS3 80.01,12.7 82.55,15.24 84.45,15.24 JP6.5
N$40
  Top 0.305: JP6.1 82.55,17.14 83.19,16.51 83.19,15.51 R10.1
  Bottom 0.305: U$8.MS1 75.56,12.06 76.83,13.33 78.11,13.33 82.55,17.78 JP6.1
N$41
  Bottom 1.422: U$8.2B Z-MOT1.1 Z-MOT.1
N$42
  Bottom 1.422: U$8.2A Z-MOT1.2 Z-MOT.2
N$43
  Bottom 1.422: U$8.1A Z-MOT1.3 Z-MOT.3
N$44
  Bottom 1.422: U$8.1B Z-MOT1.4 Z-MOT.4
N$46
  Top 0.305: R12.1 22.12,55.21 21.59,55.24 20.7,55.24 LED1.A
N$53
  Top 3.81: X4.1 12.38,20.16 F2.1-1 F2.1-2
N$54
  Top 0.406: F1.1-2 F1.1-1 9.33,10 X4.3
RESET
  Top 0.305: S1.2 37.82,3.45 37.47,3.81 37.47,5.71 33.66,9.53 U1.RES
  Bottom 0.406: RESET.1 29.72,1.02 35.95,1.02 S1.2
SCK  (1 unrouted)
  Bottom 0.406: U1.D52 92.45,15.62 92.45,13.54 93.3,12.69 93.3,7.79 93.05,7.54 87.55,7.54 87.1,7.09 87.1,0.44
SCL
  Top 0.305: R22.1 92.71,39 92.71,52.7 89.69,55.72 I2C.4
  Bottom 0.305: I2C.4 87.47,57.79 U1.D21
SDA
  Top 0.305: R21.1 91.44,45.09 90.81,45.72 90.81,51.43 89.53,52.7 I2C.3
  Bottom 0.305: I2C.3 86.52,56.2 85.72,56.2 84.14,57.79 U1.D20
THERM0
  Top 0.305: U1.A13 87.63,10.79 88.42,10.79 88.9,11.27 88.9,13.33 91.44,15.87 91.44,31.11 89.69,32.86 80.8,32.86 80.01,33.65 JP7.2 80.01,42.54 78.74,43.81 77.01,43.81 C5.+ 76.25,43.86 75.56,43.18 75.56,39.75 R7.1
THERM1
  Top 0.305: U1.A14 90.17,10.79 91.44,10.79 92.08,11.43 92.08,31.75 90.17,33.65 85.57,33.65 85.09,34.13 JP7.4 85.09,42.54 83.82,43.81 82.09,43.81 C8.+ 82.04,45.59 81.92,45.72 75.56,45.72 74.93,45.09 74.93,40.64 74.3,40 73.6,40 R1.1
THERM2
  Top 0.305: U1.A15 92.71,10.79 92.71,32.38 JP7.6 | JP7.6 90.01,35.08 | R11.1 74.3,43.61 74.3,45.72 74.93,46.35 86.36,46.35 87.12,45.59 C1.+ 87.17,43.81 88.9,43.81 90.17,42.54 JP7.6
VCC  (via drill 0.6)  (3 unrouted)
  Top 0.305: R18.1 35.56,14.33 35.56,11.43 37.47,9.53 U1.5V@0 | R22.2 R21.2 89.53,44.72 I2C.1 | R19.1 61.96,14.97 60.33,13.33 59.05,13.33 58.42,12.7 58.42,11.43 57.15,10.16 57.15,4.6 A-OUT.1 | X-.3 74.14,48.1 v71.12,45.09 71.12,44.35 71.39,44.09 R11.2 R1.2 R7.2 71.39,36.56 73.34,34.61 v73.34,32.07 | R17.1 57.78,37.46 59.69,39.37 v59.69,40.64 | R16.1 47.99,40.05 48.26,40.32 48.26,42.54 JP2.6 46.99,45.09 46.35,45.72 U$4.VDD
  Top 0.406: JP4.2 JP4.4 JP4.6 U$6.VDD | JP2.2 JP2.4 JP2.6 | X-.3 73.18,49.21 68.9,49.21 U$5.VDD | JP5.6 U$7.VDD | U$8.VDD JP6.6 JP6.4 JP6.2 81.65,20.05 81.65,16.59 81.95,16.3 81.95,13.99 78.2,13.99 77.6,14.6 77.2,14.6 77.19,14.6 R20.1 | 47.62,38.73 47.62,38.46 R16.1 46.4,36.51 45.72,36.51 45.09,35.88 45.09,33.97 46.04,33.02 49.21,33.02 51.44,30.8 51.44,29.21 49.4,27.18 48.58,27.18 46.99,25.21 U$6.VDD | U$6.VDD
  Bottom 0.305: X-.3 74.3,47.78 | 38.1,20.95 30.48,13.33 30.48,11.43 31.11,10.79 36.83,10.79 U1.5V@0 | U$8.VDD 87.63,26.03 89.53,27.94 89.53,30.16 87.95,31.75 74.61,31.75 74.3,32.07 v73.34,32.07 | v71.12,45.09 68.58,45.09 JP3.6 JP3.4 JP3.2 61.28,42.86 60.64,42.86 59.69,41.91 v59.69,40.64 | I2C.1
  Bottom 0.406: I2C.1 Z+.3 Z-.3 Y+.3 Y-.3 X+.3 X-.3 | U1.5V@2 U1.5V@1 91.44,55.24 91.44,50.16 89.53,48.26 | JP6.2 JP5.6 JP5.4 JP5.2 JP4.6 | 38.1,20.95 JP4.2
  Bottom 0.61: I2C.1 89.53,48.26 | U1.5V@0 39.69,7.94 51.12,7.94 51.1,4.6 A-OUT.1
X-DIR
  Bottom 0.305: U$6.DIR U1.A1
X-EN
  Top 0.305: R18.2 31.75,13.06 U$6.EN
  Bottom 0.305: U1.D38 93.98,34.29 92.71,33.02 92.71,32.38 | 92.71,32.38 92.71,32.07 | 92.71,32.38 90.65,30.32 90.65,27.78 88.9,26.03 88.9,20.32 88.27,19.69 38.1,19.69 31.75,13.33 U$6.EN | U$6.EN
X-MAX
  Top 0.305: C12.2 74.2,55.45 75.4,54.24 75.77,54.24 X+.1
  Bottom 0.305: X+.1 76.83,53.66 75.41,55.09 70.33,55.09 69.06,56.36 59.85,56.36 U1.D2
X-MIN
  Top 0.305: C11.2 74.08,53.39 X-.1
  Bottom 0.305: X-.1 74.3,54.13 73.98,54.45 70.01,54.45 68.74,55.72 57.94,55.72 U1.D3
X-STEP
  Bottom 0.305: U$6.STEP U1.A0
Y-DIR
  Bottom 0.305: U1.A7
  Bottom 0.406: U1.A7 68.58,10.79 U$7.DIR
Y-EN
  Top 0.305: U1.A2 55.88,12.7 58.42,15.24 R19.2
  Bottom 0.305: U$7.EN U1.A2
Y-MAX
  Top 0.305: C14.2 80.35,55.22 81.81,53.76 81.81,53.28 Y+.1
  Bottom 0.305: Y+.1 81.92,53.66 79.22,56.36 72.55,56.36 U1.D15
Y-MIN
  Top 0.305: C13.2 78.65,53.91 Y-.1
  Bottom 0.305: Y-.1 79.38,53.66 77.31,55.72 70.64,55.72 U1.D14
Y-STEP
  Bottom 0.305: U1.A6
  Bottom 0.406: U1.A6 66.04,10.79 U$7.STEP
Z-DIR
  Bottom 0.305: U$8.DIR 90.17,14.92 92.71,17.46 92.71,20.95 U1.D48
Z-EN
  Top 0.305: U1.A8 72.39,10.79 U$8.EN 73.93,13.6 R20.2
Z-MAX
  Top 0.305: 87.9,56.15 87.9,54.09 Z+.1
  Top 0.406: 87.9,56.15 88.3,56.54 90,56.54 90.1,56.65 C16.2
  Bottom 0.305: Z+.1 87,53.97 84.61,56.36 82.71,56.36 U1.D19
Z-MIN
  Top 0.305: C15.2 84.25,53.39
  Top 0.406: 84.25,53.39 Z-.1
  Bottom 0.305: Z-.1 84.45,53.66 81.76,56.36 80.17,56.36 U1.D18
Z-STEP
  Bottom 0.305: U$8.STEP 87.63,13.65 92.08,18.1 92.08,21.59 92.71,22.23 92.71,22.86 93.82,23.97 93.82,24.61 U1.D46
(copper drawn outside any net)
  shapes: Bottom circle x1

### Text on the board
tNames: 2B | 2A | 1A | 1B | 2B | 2A | 1A | 1B | + | E0 | S | D10 | - | E1 | + | Extr. 1 | MS1 | MS2 | MS3 | MS1 | MS3 | D9 | T0 | T1 | T2 | 8 | 2B | 2A | 1A | 1B | 2B | 2A | 1A | 1B | 2B | 2A | 1A | 1B | X | Y | Z | Heatbed | + | 11A+ | + | MS2 | MS1 | MS3 | MS2 | MS1 | MS3 | MS2 | MS1 | MS3 | - | GND | 8 | + | 5A | AUX-4 | AUX-1 | AUX-2 | AUX-3 | RESET | + | - | s | s | - | + | SERVOS | 1 | 1
bNames: + | + | + | +
Document: RAMPS 1.4.2.1 (RepRap Arduino MEGA Pololu Shield) | GPL v3 | reprap.org/wiki/RAMPS1.4 | Reversing input power, and inserting stepper drivers incorrectly will destroy electronics. | I2C | 21 | 20 | 12-35V Out | GND | 5V | - | D10 | + | AUX-4 | D16 | - | D17 | D9 | + | D23 | D25 | - | D11 | D27 | + | D29 | D31 | 12-35VDC In | D33 | + | D35 | 11A | D37 | - | D38 | D41 | + | 5A | D43 | - | D45 | SERVOS | AUX-1 | AUX-2 | AUX-3 / SPI | D11 | D6 | D5 | D4 | D47 | A9 | A11 | SCK | MISO | D32 | 5V | GND | D2 | D1 | GND | D63 | D48 | D42 | D65 | GND | D52 | D50 | 5V | 5V | 5V | 5V | 5V | GND | 5V | GND | A3 | A4 | 5V | A5 | A10 | D44 | A12 | NC | D53 | MOSI | D49 | D57 | D58 | D59 | D64 | D66 | D51 | 5V | GND | GND | GND | GND | Copyright 2011 Johnny Russell - UltiMachine
_tsilk: + | I2C | END STOPS | 21 | 1 | 20 | 1 | - | + | 1 | + | 1 | 1 | 1 | 1 | 1 | 1 | 1 | -